# EAGLE design Motor PCB backup test auto (EAGLE 9.2.2)
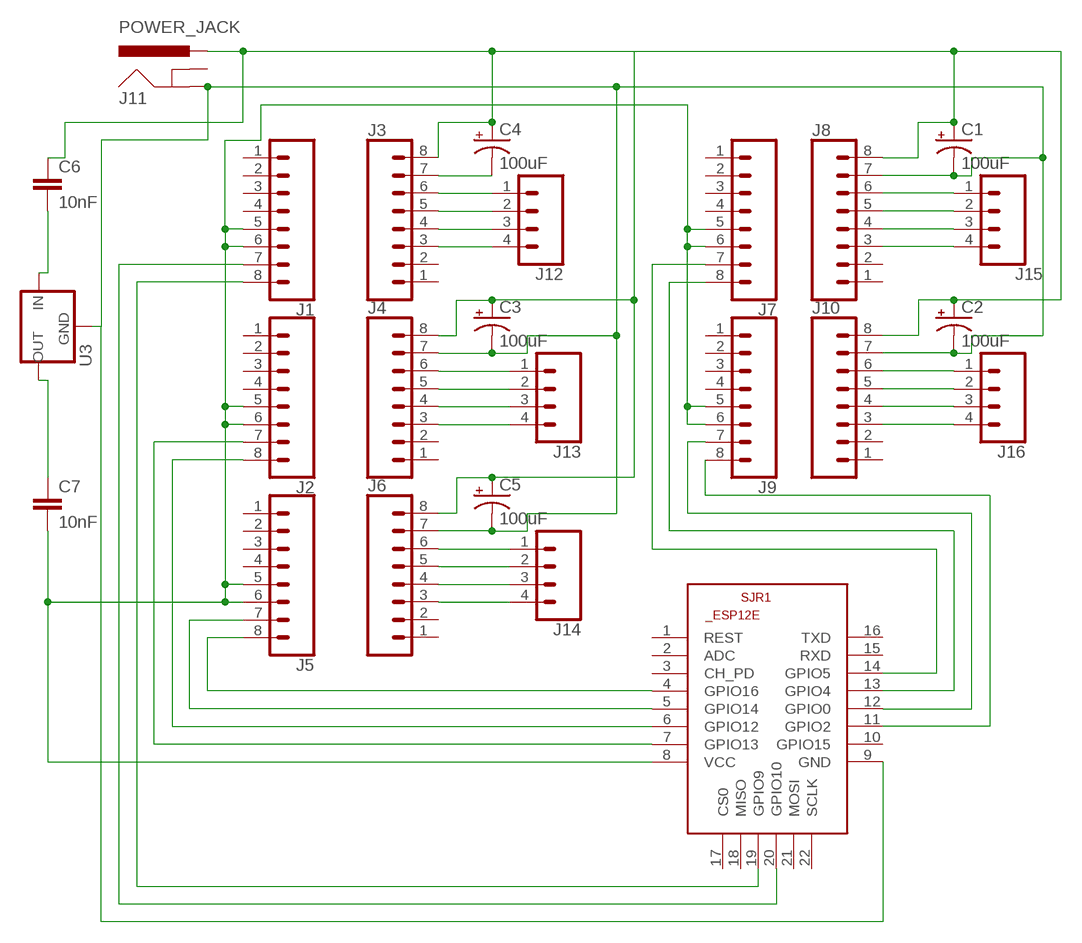
[diagram p0: schematic, sheet 1]

## Parts
C1  100uF  100UF-POLAR-EIA7343-16V-10%(TANT)  [EIA7343]
C2  100uF  100UF-POLAR-EIA7343-16V-10%(TANT)  [EIA7343]
C3  100uF  100UF-POLAR-EIA7343-16V-10%(TANT)  [EIA7343]
C4  100uF  100UF-POLAR-EIA7343-16V-10%(TANT)  [EIA7343]
C5  100uF  100UF-POLAR-EIA7343-16V-10%(TANT)  [EIA7343]
C6  10nF  10NF-0603-50V-10%  [0603]
C7  10nF  10NF-0603-50V-10%  [0603]
J1  CONN_08"  [1X08]
J2  CONN_08"  [1X08]
J3  CONN_08"  [1X08]
J4  CONN_08"  [1X08]
J5  CONN_08"  [1X08]
J6  CONN_08"  [1X08]
J7  CONN_08"  [1X08]
J8  CONN_08"  [1X08]
J9  CONN_08"  [1X08]
J10  CONN_08"  [1X08]
J11  POWER_JACK  [POWER_JACK_PTH]
J12  CONN_04JST-PTH-VERT  [JST-4-PTH-VERT]
J13  CONN_04JST-PTH-VERT  [JST-4-PTH-VERT]
J14  CONN_04JST-PTH-VERT  [JST-4-PTH-VERT]
J15  CONN_04JST-PTH-VERT  [JST-4-PTH-VERT]
J16  CONN_04JST-PTH-VERT  [JST-4-PTH-VERT]
SJR1  ESP8266-12EESP12E  [ESP8266-ESP12E]
U3  V_REG_78XX-TO-220  [TO-220-ALT]

## Nets
N$1: C1.A(+) C2.A(+) C3.A(+) C4.A(+) C5.A(+) C6.1 J3.8 J4.8 J6.8 J8.8 J10.8 J11.PWR
N$2: J4.6 J13.1
N$3: J9.8 SJR1.11(GPIO2)
N$4: J9.7 SJR1.12(GPIO0)
N$5: J7.8 SJR1.13(GPIO4)
N$6: C4.C(-) J3.7
N$7: J7.7 SJR1.14(GPIO5)
N$8: J1.7 SJR1.20(GPIO10)
N$9: J1.8 SJR1.19(GPIO9)
N$10: J2.7 SJR1.7(GPIO13)
N$11: J2.8 SJR1.6(GPIO12)
N$12: J5.7 SJR1.5(GPIO14)
N$13: J5.8 SJR1.4(GPIO16)
N$14: J3.6 J12.1
N$15: J3.5 J12.2
N$16: J3.4 J12.3
N$17: J3.3 J12.4
N$18: C1.C(-) C2.C(-) C3.C(-) C5.C(-) J4.7 J6.7 J8.7 J10.7 J11.GND SJR1.9(GND) U3.GND
N$19: J4.5 J13.2
N$20: J4.4 J13.3
N$21: J4.3 J13.4
N$22: J6.6 J14.1
N$23: J6.5 J14.2
N$24: J6.4 J14.3
N$25: J6.3 J14.4
N$26: J8.6 J15.1
N$27: J8.5 J15.2
N$28: J8.4 J15.3
N$29: J8.3 J15.4
N$30: J10.6 J16.1
N$31: J10.5 J16.2
N$32: J10.4 J16.3
N$33: J10.3 J16.4
N$34: C6.2 U3.IN
N$35: C7.1 U3.OUT
N$36: C7.2 J1.5 J1.6 J2.5 J2.6 J5.5 J5.6 J7.5 J7.6 J9.5 J9.6 SJR1.8(VCC)
Unconnected: J1.1 J1.2 J1.3 J1.4 J2.1 J2.2 J2.3 J2.4 J3.1 J3.2 J4.1 J4.2 J5.1 J5.2 J5.3 J5.4 J6.1 J6.2 J7.1 J7.2 J7.3 J7.4 J8.1 J8.2 J9.1 J9.2 J9.3 J9.4 J10.1 J10.2 J11.GNDBREAK SJR1.1(REST) SJR1.2(ADC) SJR1.3(CH_PD) SJR1.10(GPIO15) SJR1.15(RXD) SJR1.16(TXD) SJR1.17(CS0) SJR1.18(MISO) SJR1.21(MOSI) SJR1.22(SCLK)

## Library data of the parts
C1-C5 = SparkFun-Capacitors:100UF-POLAR: 100µF polarized capacitors A capacitor is a passive two-terminal electrical component used to store electrical energy temporarily in an electric field.; PROD_ID: CAP-08702
C6 C7 = SparkFun-Capacitors:10NF: 0.01uF/10nF/10,000pF ceramic capacitors A capacitor is a passive two-terminal electrical component used to store electrical energy temporarily in an electric field. CAP-09321; PROD_ID: CAP-00867
J1-J10 = SparkFun-Connectors:CONN_08: Multi connection point. Often used as Generic Header-pin footprint for 0.1 inch spaced/style header connections On any of the 0.1 inch spaced packages, you can populate with these: Break Away Headers - Straight <https://www.sparkfun.com/products/116> (PRT-00116) Break Away Male Headers - Right Angle <https://www.sparkfun.com/products/553> (PRT-00553) Female Headers <https://www.sparkfun.com/products/115> (PRT-00115) Break Away Headers - Machine Pin <https://www.sparkfun.com/products/117> (PRT-00117) Break Away Female Headers - Swiss Machine Pin <https://www.sparkfun.com/products/743> (PRT-00743) Arduino Stackable Header - 8 Pin <https://www.sparkfun.com/products/9279> (PRT-09279) For SCREWTERMINALS and SPRING TERMINALS visit here: Screw Terimnals on SparkFun.com <https://www.sparkfun.com/search/results?term=Screw+Terminals> (5mm/3.5mm/2.54mm spacing) This device is also useful as a general connection point to wire up your design to another part of your project. Our various solder wires solder well into these plated through hole pads. Hook-Up Wire - Assortment (Stranded, 22 AWG) <https://www.sparkfun.com/products/11375> (PRT-11375) Hook-Up Wire - Assortment (Solid Core, 22 AWG) <https://www.sparkfun.com/products/11367> (PRT-11367) View the entire wire category on our website here <https://www.sparkfun.com/categories/141> Special notes: Molex polarized connector foot print use with SKU : PRT-08231 with associated crimp pins and housings. 1MM SMD Version SKU: PRT-10208 NOTES ON THE VARIANTS LOCK and LOCK_LONGPADS... This footprint was designed to help hold the alignment of a through-hole component (i.e. 6-pin header) while soldering it into place. You may notice that each hole has been shifted either up or down by 0.005 of an inch from it's more standard position (which is a perfectly straight line). This slight alteration caused the pins (the squares in the middle) to touch the edges of the holes. Because they are alternating, it causes a "brace" to hold the component in place. 0.005 has proven to be the perfect amount of "off-center" position when using our standard breakaway headers. Although looks a little odd when you look at the bare footprint, once you have a header in there, the alteration is very hard to notice. Also,if you push a header all the way into place, it is covered up entirely on the bottom side.; PROD_ID: CONN-08438
J11 = SparkFun-Connectors:POWER_JACK: Power Jack Connector This is the standard 5.5mm barrel jack for power. The PTH is the most common, proven, reliable, footprint. The Slot footprint only works if the mill layer is transmitted to the PCB fab house so be warned. Here are the connectors we sell at SparkFun: DC Barrel Power Jack/Connector <https://www.sparkfun.com/products/119> (PRT-00119) DC Barrel Power Jack/Connector (SMD) <https://www.sparkfun.com/products/12748> (PRT-12748) DC Barrel Jack Adapter - Breadboard Compatible <https://www.sparkfun.com/products/10811> (PRT-10811) It is used on this SparkFun product (and many, many others): SparkFun RedBoard - Programmed with Arduino <https://www.sparkfun.com/products/12757> (DEV-12757) Also, if you need a mating power supply or connector, please check these out: Wall Adapter Power Supply - 9VDC 650mA <https://www.sparkfun.com/products/298> (TOL-00298) DC Barrel Jack Adapter - Male <https://www.sparkfun.com/products/10287> (PRT-10287); PROD_ID: CONN-08197
J12-J16 = SparkFun-Connectors:CONN_04: Multi connection point. Often used as Generic Header-pin footprint for 0.1 inch spaced/style header connections On any of the 0.1 inch spaced packages, you can populate with these: Break Away Headers - Straight <https://www.sparkfun.com/products/116> (PRT-00116) Break Away Male Headers - Right Angle <https://www.sparkfun.com/products/553> (PRT-00553) Female Headers <https://www.sparkfun.com/products/115> (PRT-00115) Break Away Headers - Machine Pin <https://www.sparkfun.com/products/117> (PRT-00117) Break Away Female Headers - Swiss Machine Pin <https://www.sparkfun.com/products/743> (PRT-00743) For SCREWTERMINALS and SPRING TERMINALS visit here: Screw Terimnals on SparkFun.com <https://www.sparkfun.com/search/results?term=Screw+Terminals> (5mm/3.5mm/2.54mm spacing) This device is also useful as a general connection point to wire up your design to another part of your project. Our various solder wires solder well into these plated through hole pads. Hook-Up Wire - Assortment (Stranded, 22 AWG) <https://www.sparkfun.com/products/11375> (PRT-11375) Hook-Up Wire - Assortment (Solid Core, 22 AWG) <https://www.sparkfun.com/products/11367> (PRT-11367) View the entire wire category on our website here <https://www.sparkfun.com/categories/141> Special notes: Molex polarized connector foot print use with SKU : PRT-08231 with associated crimp pins and housings. 1MM SMD Version SKU: PRT-10208; PROD_ID: CONN-13251
SJR1 = esp12e:ESP8266-12E: ESP8266-12E Library for Eagle CAD The author not responsible for any damages or errors!. Created by Suhail jr.lt;/author>
U3 = SparkFun-IC-Power:V_REG_78XX: Voltage Regulator Standard 78xx regulator. IGO (Input Ground Output). Spark Fun Electronics SKU : COM-00107; PROD_ID: VREG-08450; SF_ID: COM-00107

## Board
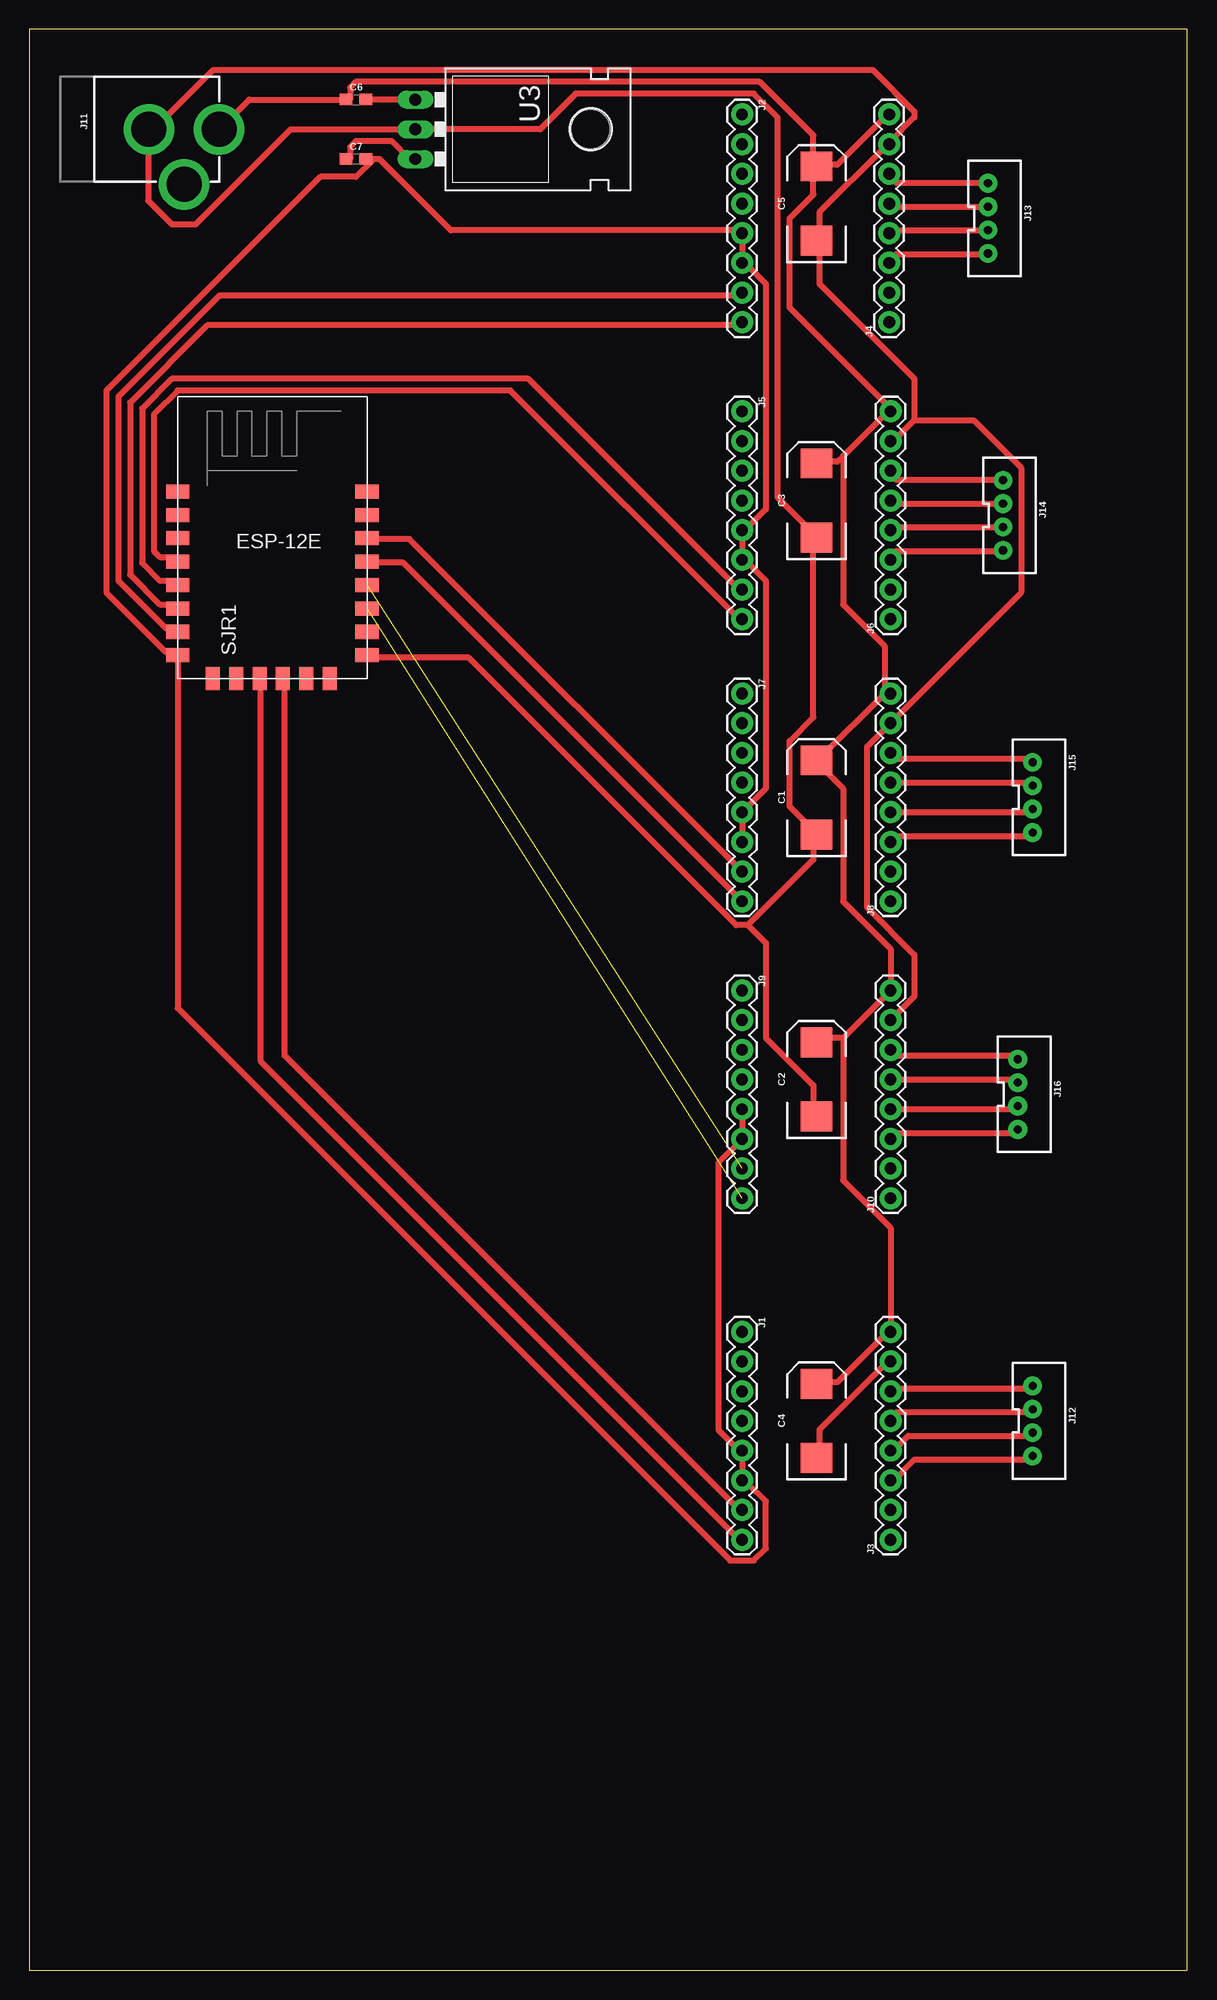
[diagram p1: board, top side]

Size 99.04 x 166.04 mm. Coordinates in mm from the lower left corner, seen from the top.
Outline: 0,0 99.04,0 99.04,166.04 0,166.04 0,0
Copper layers (1*16): Top 0.035mm / dielectric 1.5mm / Bottom 0.035mm
Design rules "default *": minimum track width 20mil, minimum drill 0.35mm, track to track 20mil, track to pad 20mil, pad to pad 6mil, via to via 6mil, smd to smd 6mil, copper to edge 40mil, drill to drill 6mil, minimum pad ring 10mil, minimum via ring 8mil, stop-mask expansion 4mil, vias tented up to drill 0mil, thermal gap 10mil

### Footprints (pad centres in the part's own frame; a part is rotated, then mirrored left to right if it is on the bottom)
EIA7343 = smd 2.55 x 2.7: A 3.17,0; C -3.17,0
0603 = smd 1.1 x 1: 1 -0.85,0; 2 0.85,0
1X08 = drill 1.016 pad 1.88: 1 0,0; 2 2.54,0; 3 5.08,0; 4 7.62,0; 5 10.16,0; 6 12.7,0; 7 15.24,0; 8 17.78,0
POWER_JACK_PTH = drill 2.997 pad 4.318: GND 0,7.7; GNDBREAK 4.7,10.7; PWR 0,13.7
JST-4-PTH-VERT = drill 0.7 pad 1.6: 1 -3,-0.55; 2 -1,-0.55; 3 1,-0.55; 4 3,-0.55
ESP8266-ESP12E = smd 2 x 1.2: 1 -7.62,5.84; 2 -7.62,3.84; 3 -7.62,1.84; 4 -7.62,-0.16; 5 -7.62,-2.16; 6 -7.62,-4.16; 7 -7.62,-6.16; 8 -7.62,-8.16; 9 8.58,-8.16; 10 8.58,-6.16; 11 8.58,-4.16; 12 8.58,-2.16; 13 8.58,-0.16; 14 8.58,1.84; 15 8.58,3.84; 16 8.58,5.84 | smd 1.2 x 2: 17 -4.62,-10.16; 18 -2.62,-10.16; 19 -0.62,-10.16; 20 1.38,-10.16; 21 3.38,-10.16; 22 5.38,-10.16
TO-220-ALT = drill 1.016 long: GND 0,-3.81; IN -2.54,-3.81; OUT 2.54,-3.81 | hole 3.302: 0,11.176

### Placement (x,y rotation side)
C1  67.31,100.33 90 top
C2  67.31,76.2 90 top
C3  67.31,125.73 90 top
C4  67.31,46.99 90 top
C5  67.31,151.13 90 top
C6  27.94,160.02 0 top
C7  27.94,154.94 0 top
J1  60.96,54.61 270 top
J2  60.96,158.75 270 top
J3  73.66,36.83 90 top
J4  73.53,140.97 90 top
J5  60.96,133.35 270 top
J6  73.66,115.57 90 top
J7  60.96,109.22 270 top
J8  73.66,91.44 90 top
J9  60.96,83.82 270 top
J10  73.66,66.04 90 top
J11  2.54,157.48 270 top
J12  86.36,46.99 270 top
J13  82.55,149.86 270 top
J14  83.82,124.46 270 top
J15  86.36,100.33 270 top
J16  85.09,74.93 270 top
SJR1  20.32,120.65 0 top
U3  36.83,157.48 270 top

### Tracks (layer width: path | path; a pad name or v marks a point on that pad's centre or on a via)
N$1
  Top 0.508: 73.66,54.86 69.09,50.29 67.56,50.29 C4.A | 69.6,79.76 67.56,79.76 C2.A | 69.6,79.76 J10.8 73.66,87.38 69.6,91.44 69.6,101.09 67.56,103.12 C1.A 67.56,103.63 73.15,109.22 | 73.66,54.86 73.66,63.5 69.6,67.56 69.6,79.76 | 73.66,54.86 J3.8 | J11.PWR 16.26,157.48 18.8,160.02 C6.1 27.43,160.02 27.43,161.04 27.94,161.54 62.48,161.54 67.06,156.97 67.06,154.43 C5.A | C5.A 67.56,154.43 69.09,154.43 73.15,158.5 J4.8 | 73.66,133.6 69.6,129.54 | 69.6,129.54 69.09,129.03 67.56,129.03 C3.A | 73.66,133.6 65.02,142.24 65.02,149.86 67.06,151.89 67.06,153.92 C5.A | 73.66,133.6 J6.8 | 73.15,109.22 73.15,113.28 69.6,116.84 69.6,129.54 | 73.15,109.22 J8.8
N$2
  Top 0.508: J13.1 81.79,152.91 74.17,152.91 73.66,153.42 J4.6
N$3  (1 unrouted)
N$4  (1 unrouted)
N$5
  Top 0.508: J7.8 32,120.4 28.96,120.4 SJR1.13
N$6
  Top 0.508: C4.C 67.56,44.2 67.56,46.23 73.66,52.32 J3.7
N$7
  Top 0.508: J7.7 32.51,122.43 28.96,122.43 SJR1.14
N$8
  Top 0.508: SJR1.20 21.84,110.24 21.84,78.23 60.96,39.12 J1.7
N$9
  Top 0.508: SJR1.19 19.81,110.24 19.81,77.72 60.96,36.58 J1.8
N$10
  Top 0.508: SJR1.7 12.7,114.81 11.68,114.81 7.62,118.87 7.62,134.62 16.26,143.26 60.96,143.26 J2.7
N$11
  Top 0.508: SJR1.6 12.7,116.84 11.18,116.84 8.64,119.38 8.64,134.11 15.24,140.72 60.96,140.72 J2.8
N$12
  Top 0.508: SJR1.5 12.7,118.87 11.18,118.87 9.65,120.4 9.65,133.6 12.19,136.14 42.67,136.14 60.96,117.86 J5.7
N$13
  Top 0.508: SJR1.4 12.7,120.9 11.18,120.9 10.67,121.41 10.67,133.1 12.7,135.13 41.15,135.13 60.96,115.32 J5.8
N$14
  Top 0.508: J12.1 85.34,49.78 73.66,49.78 J3.6
N$15
  Top 0.508: J12.2 85.34,47.75 74.17,47.75 73.66,47.24 J3.5
N$16
  Top 0.508: J12.3 85.34,45.72 75.18,45.72 73.66,44.2 J3.4
N$17
  Top 0.508: J12.4 85.34,43.69 75.69,43.69 73.66,41.66 J3.3
N$18
  Top 0.508: J10.7 75.69,83.31 75.69,86.87 71.63,90.93 71.63,104.65 J8.7 84.84,117.86 84.84,128.52 80.77,132.59 75.69,132.59 | 75.69,132.59 74.17,131.06 73.66,131.06 J6.7 | 75.69,132.59 75.69,136.14 67.56,144.27 67.56,147.83 C5.C 67.56,148.34 67.56,150.37 73.15,155.96 J4.7 73.66,156.46 75.69,158.5 75.69,159 72.14,162.56 15.75,162.56 10.67,157.48 J11.GND 10.16,157.48 10.16,151.38 12.19,149.35 14.22,149.35 22.35,157.48 U3.GND 43.69,157.48 46.74,160.53 61.98,160.53 64.01,158.5 64.01,125.98 67.06,122.94 C3.C 67.06,122.43 67.06,107.19 65.02,105.16 65.02,99.57 67.06,97.54 C1.C 67.06,97.03 67.06,95 61.47,89.41 | 61.47,89.41 60.45,89.41 37.59,112.27 28.96,112.27 SJR1.9 | 61.47,89.41 62.99,87.88 62.99,79.76 67.06,75.69 67.06,73.15 C2.C
N$19
  Top 0.508: J13.2 81.79,150.88 73.66,150.88 J4.5
N$20
  Top 0.508: J13.3 81.79,148.84 73.66,148.84 J4.4
N$21
  Top 0.508: J13.4 81.79,146.81 74.17,146.81 73.66,146.3 J4.3
N$22
  Top 0.508: J14.1 82.8,127.51 74.17,127.51 73.66,128.02 J6.6
N$23
  Top 0.508: J14.2 82.8,125.48 73.66,125.48 J6.5
N$24
  Top 0.508: J14.3 82.8,123.44 73.66,123.44 J6.4
N$25
  Top 0.508: J14.4 82.8,121.41 74.17,121.41 73.66,120.9 J6.3
N$26
  Top 0.508: J8.6 74.17,103.63 85.34,103.63 J15.1
N$27
  Top 0.508: J8.5 85.34,101.6 J15.2
N$28
  Top 0.508: J8.4 85.34,99.06 J15.3
N$29
  Top 0.508: J8.3 74.17,97.03 85.34,97.03 J15.4
N$30
  Top 0.508: J10.6 74.17,78.23 84.33,78.23 J16.1
N$31
  Top 0.508: J10.5 84.33,76.2 J16.2
N$32
  Top 0.508: J10.4 84.33,73.66 J16.3
N$33
  Top 0.508: J10.3 74.17,71.63 84.33,71.63 J16.4
N$34
  Top 0.508: U3.IN C6.2
N$35
  Top 0.508: U3.OUT 32.51,154.94 30.99,156.46 27.94,156.46 27.43,155.96 27.43,154.94 C7.1
N$36
  Top 0.508: J9.5 J9.6 58.93,69.09 58.93,46.23 60.45,44.7 60.96,44.7 J1.5 J1.6 60.96,41.66 61.47,41.66 62.99,40.13 62.99,36.07 61.98,35.05 59.94,35.05 12.7,82.3 SJR1.8 12.7,112.78 11.68,112.78 6.6,117.86 6.6,135.13 24.89,153.42 27.94,153.42 29.46,154.94 | J7.6 J7.5 62.99,101.09 62.99,118.87 60.96,120.9 | 60.96,120.9 J5.5 60.96,123.44 61.47,123.44 62.99,124.97 62.99,144.27 60.96,146.3 | 60.96,120.9 J5.6 | 29.46,154.94 29.97,154.94 36.07,148.84 60.96,148.84 J2.5 60.96,146.3 | 29.46,154.94 C7.2 | 60.96,146.3 J2.6